# Altium schematic sheet converter.SchDoc
size 594 x 420 mm; Address1: Address1; Address2: Address2; Address3: Address3; Address4: Address4; DocumentNumber: АБВГ.123456.001 Э3; SheetNumber: 1; SheetTotal: 2; Scale: 1:1; DocumentType: Схема электрическая принципиальная; FirstReferrence: АБВГ.123456.001
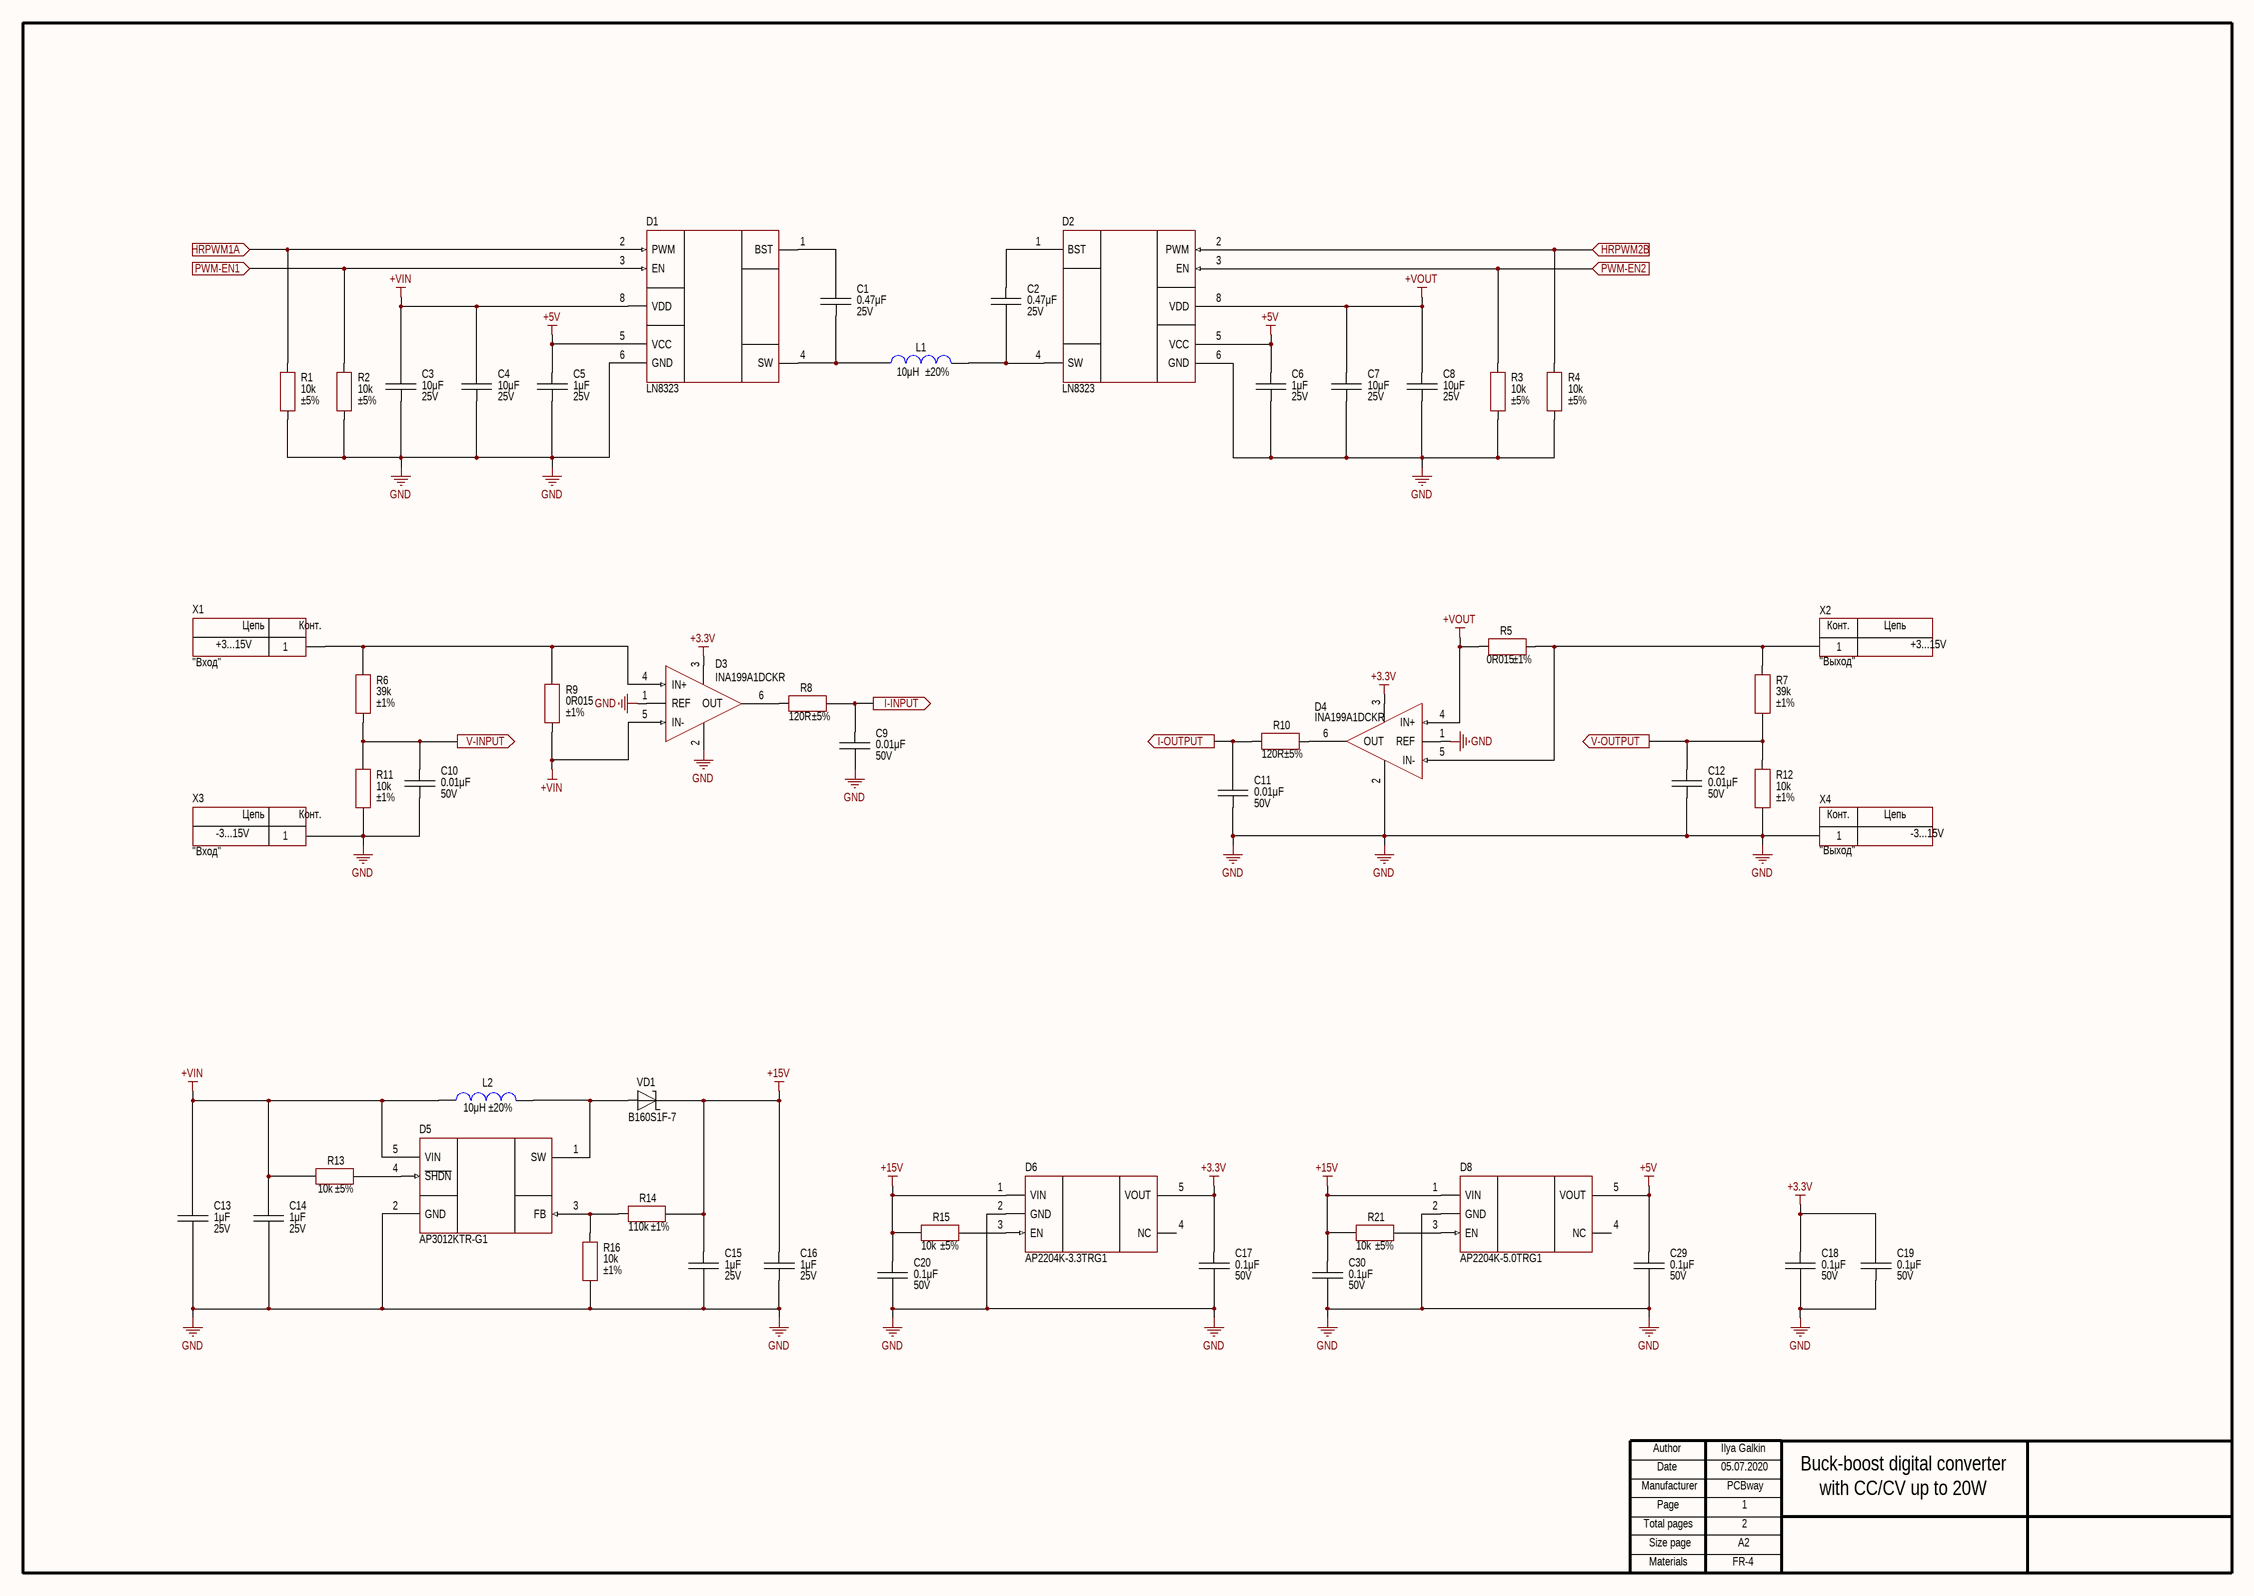
[diagram p0: converter.SchDoc]

## Parts
C1  value 0.47μF  Voltage: 25V  [CAP: 0805]
C2  value 0.47μF  Voltage: 25V  [CAP: 0805]
C3  value 10μF  Voltage: 25V  [CAP: 1210]
C4  value 10μF  Voltage: 25V  [CAP: 1210]
C5  value 1μF  Voltage: 25V  [CAP: 0603]
C6  value 1μF  Voltage: 25V  [CAP: 0603]
C7  value 10μF  Voltage: 25V  [CAP: 1210]
C8  value 10μF  Voltage: 25V  [CAP: 1210]
C9  value 0.01μF  Voltage: 50V  [CAP: 0603]
C10  value 0.01μF  Voltage: 50V  [CAP: 0603]
C11  value 0.01μF  Voltage: 50V  [CAP: 0603]
C12  value 0.01μF  Voltage: 50V  [CAP: 0603]
C13  value 1μF  Voltage: 25V  [CAP: 0603]
C14  value 1μF  Voltage: 25V  [CAP: 0603]
C15  value 1μF  Voltage: 25V  [CAP: 0603]
C16  value 1μF  Voltage: 25V  [CAP: 0603]
C17  value 0.1μF  Voltage: 50V  [CAP: 0603]
C18  value 0.1μF  Voltage: 50V  [CAP: 0603]
C19  value 0.1μF  Voltage: 50V  [CAP: 0603]
C20  value 0.1μF  Voltage: 50V  [CAP: 0603]
C29  value 0.1μF  Voltage: 50V  [CAP: 0603]
C30  value 0.1μF  Voltage: 50V  [CAP: 0603]
D1  (no value)  [8-SOIC-PAD]
D2  (no value)  [8-SOIC-PAD]
D3  (no value)  [SC70-6]
D4  (no value)  [SC70-6]
D5  (no value)  [SOT23-5]
D6  (no value)  [SOT23-5]
D8  PartNumber: AP2204K-5.0TRG1  [SOT23-5]
L1  value 10μH  Tolerance: ±20%  [IND: SDR1006]
L2  value 10μH  Tolerance: ±20%  [IND: SDR0403]
R1  value 10k  Tolerance: ±5%  [RES: 0603]
R2  value 10k  Tolerance: ±5%  [RES: 0603]
R3  value 10k  Tolerance: ±5%  [RES: 0603]
R4  value 10k  Tolerance: ±5%  [RES: 0603]
R5  value 0R015  Tolerance: ±1%  [RES: CSS2H (2512)]
R6  value 39k  Tolerance: ±1%  [RES: 0603]
R7  value 39k  Tolerance: ±1%  [RES: 0603]
R8  value 120R  Tolerance: ±5%  [RES: 0603]
R9  value 0R015  Tolerance: ±1%  [RES: CSS2H (2512)]
R10  value 120R  Tolerance: ±5%  [RES: 0603]
R11  value 10k  Tolerance: ±1%  [RES: 0603]
R12  value 10k  Tolerance: ±1%  [RES: 0603]
R13  value 10k  Tolerance: ±5%  [RES: 0603]
R14  value 110k  Tolerance: ±1%  [RES: 0603]
R15  value 10k  Tolerance: ±5%  [RES: 0603]
R16  value 10k  Tolerance: ±1%  [RES: 0603]
R21  value 10k  Tolerance: ±5%  [RES: 0603]
VD1  PartNumber: B160S1F-7  [DIODE: SOD123F]
X1  CommentText: "Вход"  [CON: 8191]
X2  CommentText: "Выход"  [CON: 8191]
X3  CommentText: "Вход"  [CON: 8191]
X4  CommentText: "Выход"  [CON: 8191]

## Ports
HRPWM1A (in), HRPWM2B (in), I-INPUT (out), I-OUTPUT (out), PWM-EN1 (in), PWM-EN2 (in), V-INPUT (out), V-OUTPUT (out)

## Nets
+3.3V: C17.2 C18.2 C19.2 D3.3(V+) D4.3(V+) D6.5(VOUT)
+5V: C5.2 C6.2 C29.2 D1.5(VCC) D2.5(VCC) D8.5(VOUT)
+15V: C15.2 C16.2 C20.2 C30.2 D6.1(VIN) D8.1(VIN) R14.1 R15.2 R21.2 VD1.2
+VIN: C3.2 C4.2 C13.2 C14.2 D1.8(VDD) D3.5(IN-) D5.5(VIN) L2.2 R9.2 R13.2
+VOUT: C7.2 C8.2 D2.8(VDD) D4.4(IN+) R5.1
GND: C3.1 C4.1 C5.1 C6.1 C7.1 C8.1 C9.1 C10.1 C11.1 C12.1 C13.1 C14.1 C15.1 C16.1 C17.1 C18.1 C19.1 C20.1 C29.1 C30.1 D1.6(GND) D2.6(GND) D3.1(REF) D3.2(V-) D4.1(REF) D4.2(V-) D5.2(GND) D6.2(GND) D8.2(GND) R1.1 R2.1 R3.1 R4.1 R11.1 R12.1 R16.1 X3.1 X4.1
HRPWM1A: D1.2(PWM) R1.2 ; port HRPWM1A
HRPWM2B: D2.2(PWM) R4.2 ; port HRPWM2B
I-INPUT: C9.2 R8.2 ; port I-INPUT
I-OUTPUT: C11.2 R10.1 ; port I-OUTPUT
PWM-EN1: D1.3(EN) R2.2 ; port PWM-EN1
PWM-EN2: D2.3(EN) R3.2 ; port PWM-EN2
V-INPUT: C10.2 R6.1 R11.2 ; port V-INPUT
V-OUTPUT: C12.2 R7.1 R12.2 ; port V-OUTPUT
NetC1_1: C1.1 D1.4(SW) L1.2
NetC1_2: C1.2 D1.1(BST)
NetC2_1: C2.1 D2.4(SW) L1.1
NetC2_2: C2.2 D2.1(BST)
NetD3_4: D3.4(IN+) R6.2 R9.1 X1.1
NetD3_6: D3.6(OUT) R8.1
NetD4_5: D4.5(IN-) R5.2 R7.2 X2.1
NetD4_6: D4.6(OUT) R10.2
NetD5_1: D5.1(SW) L2.1 VD1.1
NetD5_3: D5.3(FB) R14.2 R16.2
NetD5_4: D5.4(~{SHDN}) R13.1
NetD6_3: D6.3(EN) R15.1
NetD8_3: D8.3(EN) R21.1

Not connected (* = marked no-connect by the designer): D6 4(NC); D8 4(NC)

## Notes on the sheet
- +3...15V
- -3...15V
- Ilya Galkin
- 05.07.2020
- PCBway
- 1
- Buck-boost digital converter
- with CC/CV up to 20W
- 2
- FR-4
- Author
- Manufacturer
- Date
- Page
- Total pages
- Size page
- A2
- Materials
- (in symbol Connector_single_power) Цепь; Конт.

## Library data of the parts
C1 C2 = Ceramic_0805: Manufacturer: Samsung; PartNumber: CL21B474KAFNNNG; ValueManufacturerPartNumber: Ceramic capacitor, 0.47μF, X7R, ±10%, 25V, 0805, -55...+125°C; TypeCapacitor: Ceramic capacitor; Tolerance: ±10%; TypeDielectric: X7R; Package: 0805; HelpURL: https://www.digikey.com/product-detail/en/samsung-electro-mechanics/CL21B474KAFNNNG/1276-6480-1-ND/5958108; Temperature: -55...+125°C
C3 C4 C7 C8 = Ceramic_1210: Manufacturer: Samsung; PartNumber: CL32B106KAJNNNE; ValueManufacturerPartNumber: Ceramic capacitor, 10μF, X7R, ±10%, 25V, 1210, -55...+125°C; TypeCapacitor: Ceramic capacitor; Tolerance: ±10%; TypeDielectric: X7R; Package: 1210; HelpURL: https://www.digikey.com/product-detail/en/samsung-electro-mechanics/CL32B106KAJNNNE/1276-1807-1-ND/3889893; Temperature: -55...+125°C
C5 C6 C13-C16 = Ceramic_0603: Manufacturer: Samsung; PartNumber: CL10B105KA8NNNC; ValueManufacturerPartNumber: Ceramic capacitor, 1μF, X7R, ±10%, 25V, 0603, -55...+125°C; TypeCapacitor: Ceramic capacitor; Tolerance: ±10%; TypeDielectric: X7R; Package: 0603; HelpURL: https://www.digikey.com/product-detail/en/samsung-electro-mechanics/CL10B105KA8NNNC/1276-1184-1-ND/3889270; Temperature: -55...+125°C
C9-C12 = Ceramic_0603: Manufacturer: Yageo; PartNumber: CL10B103KB8NNNC; ValueManufacturerPartNumber: Ceramic capacitor, 0.01μF, X7R, ±10%, 50V, 0603, -55...+125°C; TypeCapacitor: Ceramic capacitor; Tolerance: ±10%; TypeDielectric: X7R; Package: 0603; HelpURL: https://www.digikey.com/product-detail/en/samsung-electro-mechanics/CL10B103KB8NNNC/1276-1009-1-ND/3889095; Temperature: -55...+125°C
C17-C20 C29 C30 = Ceramic_0603: Manufacturer: Yageo; PartNumber: CL10B104KB8WPND; ValueManufacturerPartNumber: Ceramic capacitor, 0.1μF, X7R, ±10%, 50V, 0603, -55...+125°C; TypeCapacitor: Ceramic capacitor; Tolerance: ±10%; TypeDielectric: X7R; Package: 0603; HelpURL: https://www.digikey.com/product-detail/en/samsung-electro-mechanics/CL10B104KB8WPND/1276-CL10B104KB8WPNDCT-ND/11488014; Temperature: -55...+125°C
D1 D2 = LN8323: Gate driver; Manufacturer: Chipown; ValueManufacturerPartNumber: Half-bridge module, 2N channel, 100kHz, 6A, supply 4...30V, -40...+125°C, 8-SOIC-PAD; VoltageSupply: supply 4...30V; Frequency: 100kHz; CurrentOutput: 6A; VoltageWork: 2N channel; HelpURL: http://chipown.com/product.asp?id=416; Package: 8-SOIC-PAD; ComponentType: Half-bridge module; Temperature: -40...+125°C; PartNumber: LN8323
D3 D4 = INA199A1DCKR: Current monitor; Manufacturer: Texas Instruments; ValueManufacturerPartNumber: IC current monitor, ±1.5%, 50V/V, -0.3...+26V, -40...+125°C, SOT23-5; Supply: -0.3...+26V; Accuracy: ±1.5%; GainBandwidth: 50V/V; HelpURL: https://www.digikey.com/product-detail/en/texas-instruments/INA199A1DCKR/296-27329-1-ND/2279290; Package: SOT23-5; ComponentType: IC current monitor; Temperature: -40...+125°C; PartNumber: INA199A1DCKR
D5 = AP3012KTR-G1: Boost converter; Manufacturer: Diodes Incorporated; ValueManufacturerPartNumber: DC/DC boost converter, input 2.6...16V, 1.5MHz, output 3...29V, 0.5A, -40...+85°C, SOT23-5; VoltageInput: input 2.6...16V; Frequency: 1.5MHz; CurrentOutput: 0.5A; VoltageOutput: output 3...29V; HelpURL: https://www.digikey.com/product-detail/en/diodes-incorporated/AP3012KTR-G1/AP3012KTR-G1DICT-ND/4505297; Package: SOT23-5; ComponentType: DC/DC boost converter; Temperature: -40...+85°C; PartNumber: AP3012KTR-G1
D6 = AP2204K-3.3TRG1: Linear voltage regulator; Manufacturer: Diodes Incorporated; ValueManufacturerPartNumber: Linear voltage regulator, input 4...24V, 0.5V, output 3.3V, 0.15A, -40...+85°C, SOT23-6; VoltageInput: input 4...24V; MaxDropout: 0.5V; CurrentOutput: 0.15A; VoltageOutput: output 3.3V; HelpURL: https://www.digikey.com/product-detail/en/diodes-incorporated/AP2204K-3.3TRG1/AP2204K-3.3TRG1DICT-ND/4505288; Package: SOT23-6; ComponentType: Linear voltage regulator; Temperature: -40...+85°C; PartNumber: AP2204K-3.3TRG1
D8 = AP2204K-3.3TRG1: Linear voltage regulator; Manufacturer: Diodes Incorporated; ValueManufacturerPartNumber: Linear voltage regulator, input 4...24V, 0.5V, output 5V, 0.15A, -40...+85°C, SOT23-6; VoltageInput: input 4...24V; MaxDropout: 0.5V; CurrentOutput: 0.15A; VoltageOutput: output 5V; HelpURL: https://www.digikey.com/product-detail/en/diodes-incorporated/AP2204K-5-0TRG1/AP2204K-5-0TRG1DICT-ND/4505289; Package: SOT23-6; ComponentType: Linear voltage regulator; Temperature: -40...+85°C
L1 = Inductor_SDR1006: Manufacturer: Bourns; PartNumber: SDR1006-100ML; ValueManufacturerPartNumber: Fixed inductor, 10μH, ±20%, SDR0805, 2.6A, -40...+125°C; TypeInductor: Fixed inductor; MaxCurrent: 2.6A; Package: SDR0805; HelpURL: https://www.digikey.com/product-detail/en/bourns-inc/SDR1006-100ML/SDR1006-100MLCT-ND/2127202; Temperature: -40...+125°C
L2 = Inductor_SDR0403: Manufacturer: Bourns; PartNumber: SDR0403-100ML; ValueManufacturerPartNumber: Fixed inductor, 10μH, ±20%, SDR0403, 1.15A, -40...+125°C; TypeInductor: Fixed inductor; MaxCurrent: 1.15A; Package: SDR0403; HelpURL: https://www.digikey.com/product-detail/en/bourns-inc/SDR0403-100ML/SDR0403-100MLCT-ND/2127080; Temperature: -40...+125°C
R1-R4 R13 R15 R21 = Resistor_0603: Manufacturer: Yageo; PartNumber: RC0603JR-0710KL; ValueManufacturerPartNumber: Resistor film, 10k, ±5%, 0603, 0.1W, -55...+125°C; TypeResistor: Resistor film; Power: 0.1W; Package: 0603; HelpURL: https://www.digikey.com/product-detail/en/yageo/RC0603JR-0710KL/311-10KGRCT-ND/729647; Temperature: -55...+125°C
R5 R9 = Shunt: Manufacturer: Yageo; PartNumber: PE2512FKE7W0R015L; ValueManufacturerPartNumber: Resistor film, 0R015, ±1%, 2512, 2W, -55...+170°C; TypeResistor: Resistor film; Power: 2W; Package: 2512; HelpURL: https://www.digikey.com/product-detail/en/yageo/PE2512FKE7W0R015L/YAG2165CT-ND/5139613; Temperature: -55...+170°C
R6 R7 = Resistor_0603: Manufacturer: Yageo; PartNumber: RC0603FR-0739KL; ValueManufacturerPartNumber: Resistor film, 39k, ±1%, 0603, 0.1W, -55...+125°C; TypeResistor: Resistor film; Power: 0.1W; Package: 0603; HelpURL: https://www.digikey.com/product-detail/en/yageo/RC0603FR-0739KL/311-39-0KHRCT-ND/730142; Temperature: -55...+125°C
R8 R10 = Resistor_0603: Manufacturer: Yageo; PartNumber: RC0603JR-07120RL; ValueManufacturerPartNumber: Resistor film, 120R, ±5%, 0603, 0.1W, -55...+125°C; TypeResistor: Resistor film; Power: 0.1W; Package: 0603; HelpURL: https://www.digikey.com/product-detail/en/yageo/RC0603JR-07120RL/311-120GRCT-ND/729653; Temperature: -55...+125°C
R11 R12 R16 = Resistor_0603: Manufacturer: Yageo; PartNumber: RC0603FR-0710KL; ValueManufacturerPartNumber: Resistor film, 10k, ±1%, 0603, 0.1W, -55...+125°C; TypeResistor: Resistor film; Power: 0.1W; Package: 0603; HelpURL: https://www.digikey.com/product-detail/en/yageo/RC0603FR-0710KL/311-10-0KHRCT-ND/729827; Temperature: -55...+125°C
R14 = Resistor_0603: Manufacturer: Yageo; PartNumber: RC0603FR-07110KL; ValueManufacturerPartNumber: Resistor film, 110k, ±1%, 0603, 0.1W, -55...+125°C; TypeResistor: Resistor film; Power: 0.1W; Package: 0603; HelpURL: https://www.digikey.com/product-detail/en/yageo/RC0603FR-07110KL/311-110KHRCT-ND/729852; Temperature: -55...+125°C
VD1 = Schottky_single: Manufacturer: Diodes Incorporated; ValueManufacturerPartNumber: Schottky diode, 60B160S1F-7, 1A, 650mV, 45pF, SOD-123F, -55...+150°C; TypeDiode: Schottky diode; Voltage: 60B160S1F-7; Current: 1A; VoltageDrop: 650mV; RecoveryTime: 45pF; Package: SOD-123F; HelpURL: https://www.digikey.com/product-detail/en/diodes-incorporated/B160S1F-7/B160S1F-7DICT-ND/7784161; Temperature: -55...+150°C
X1-X4 = Connector_single_power: Manufacturer: Keystone; ValueManufacturerPartNumber: Power connector, 500V, 15A; PartNumber: 8191; TypeConnector: Power connector; VoltageMax: 500V; CurrentMax: 15A; HelpURL: https://ru.mouser.com/ProductDetail/Keystone-Electronics/8191?qs=lQmX4aIt5iAMQ8PQTpZ%2Fwg%3D%3D